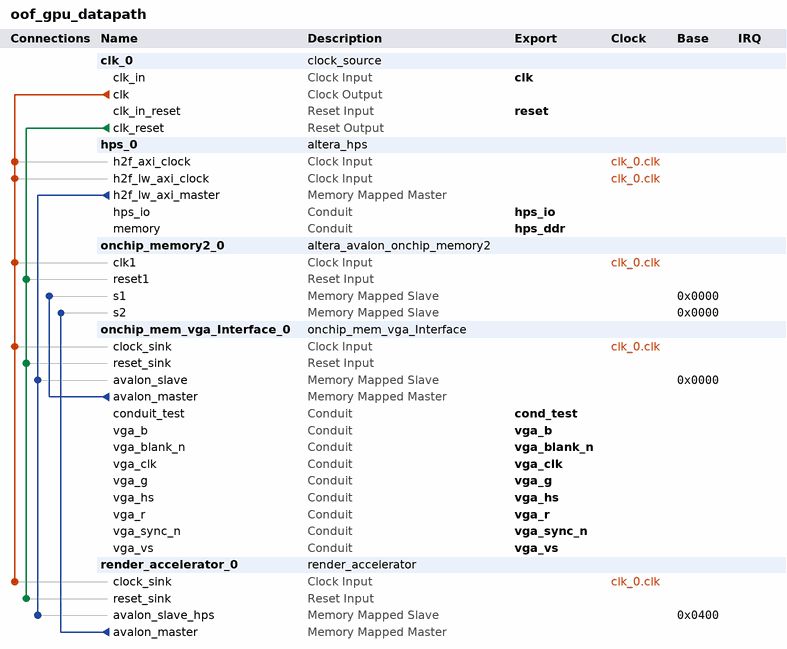
[diagram p0: system contents]
# Platform Designer (Qsys) system oof_gpu_datapath, Cyclone V 5CSEMA5F31C6
# Parameters at their usual value, and those the tool derives, are not listed.
package require -exact qsys 19.1
create_system oof_gpu_datapath
set_project_property DEVICE_FAMILY {Cyclone V}
set_project_property DEVICE 5CSEMA5F31C6

add_instance clk_0 clock_source 19.1
set_instance_parameter_value clk_0 clockFrequency 50000000

add_instance hps_0 altera_hps 19.1
set_instance_parameter_value hps_0 EMAC1_Mode RGMII
set_instance_parameter_value hps_0 EMAC1_PinMuxing {HPS I/O Set 0}
set_instance_parameter_value hps_0 F2SCLK_COLDRST_Enable false
set_instance_parameter_value hps_0 F2SCLK_DBGRST_Enable false
set_instance_parameter_value hps_0 F2SCLK_WARMRST_Enable false
set_instance_parameter_value hps_0 F2SINTERRUPT_Enable false
set_instance_parameter_value hps_0 F2S_Width 0
set_instance_parameter_value hps_0 FPGA_PERIPHERAL_OUTPUT_CLOCK_FREQ_EMAC0_GTX_CLK 125
set_instance_parameter_value hps_0 FPGA_PERIPHERAL_OUTPUT_CLOCK_FREQ_EMAC0_MD_CLK 2.5
set_instance_parameter_value hps_0 FPGA_PERIPHERAL_OUTPUT_CLOCK_FREQ_EMAC1_GTX_CLK 125
set_instance_parameter_value hps_0 FPGA_PERIPHERAL_OUTPUT_CLOCK_FREQ_EMAC1_MD_CLK 2.5
set_instance_parameter_value hps_0 HPS_PROTOCOL DDR3
set_instance_parameter_value hps_0 I2C0_Mode I2C
set_instance_parameter_value hps_0 I2C0_PinMuxing {HPS I/O Set 0}
set_instance_parameter_value hps_0 I2C1_Mode I2C
set_instance_parameter_value hps_0 I2C1_PinMuxing {HPS I/O Set 0}
set_instance_parameter_value hps_0 LWH2F_Enable true
set_instance_parameter_value hps_0 MEM_BANKADDR_WIDTH 3
set_instance_parameter_value hps_0 MEM_CLK_FREQ 400.0
set_instance_parameter_value hps_0 MEM_COL_ADDR_WIDTH 10
set_instance_parameter_value hps_0 MEM_DQ_WIDTH 32
set_instance_parameter_value hps_0 MEM_DRV_STR RZQ/6
set_instance_parameter_value hps_0 MEM_ROW_ADDR_WIDTH 15
set_instance_parameter_value hps_0 MEM_RTT_NOM RZQ/6
set_instance_parameter_value hps_0 MEM_RTT_WR {Dynamic ODT off}
set_instance_parameter_value hps_0 MEM_TCL 7
set_instance_parameter_value hps_0 MEM_TFAW_NS 45.0
set_instance_parameter_value hps_0 MEM_TRAS_NS 36.0
set_instance_parameter_value hps_0 MEM_TRCD_NS 13.125
set_instance_parameter_value hps_0 MEM_TRFC_NS 300.0
set_instance_parameter_value hps_0 MEM_TRP_NS 13.125
set_instance_parameter_value hps_0 MEM_VENDOR JEDEC
set_instance_parameter_value hps_0 MEM_WTCL 7
set_instance_parameter_value hps_0 QSPI_Mode {1 SS}
set_instance_parameter_value hps_0 QSPI_PinMuxing {HPS I/O Set 0}
set_instance_parameter_value hps_0 REF_CLK_FREQ 25.0
set_instance_parameter_value hps_0 S2FCLK_USER1CLK_Enable true
set_instance_parameter_value hps_0 S2FCLK_USER1CLK_FREQ 25.0
set_instance_parameter_value hps_0 S2FCLK_USER2CLK 5
set_instance_parameter_value hps_0 S2F_Width 2
set_instance_parameter_value hps_0 SDIO_Mode {4-bit Data}
set_instance_parameter_value hps_0 SDIO_PinMuxing {HPS I/O Set 0}
set_instance_parameter_value hps_0 SPIM0_Mode {Single Slave Select}
set_instance_parameter_value hps_0 SPIM0_PinMuxing {HPS I/O Set 0}
set_instance_parameter_value hps_0 SPIM1_Mode N/A
set_instance_parameter_value hps_0 SPIM1_PinMuxing Unused
set_instance_parameter_value hps_0 STM_Enable false
set_instance_parameter_value hps_0 TIMING_BOARD_AC_SKEW 0.02
set_instance_parameter_value hps_0 TIMING_BOARD_AC_TO_CK_SKEW 0.01
set_instance_parameter_value hps_0 TIMING_BOARD_DQ_TO_DQS_SKEW 0.05
set_instance_parameter_value hps_0 TIMING_BOARD_MAX_CK_DELAY 0.03
set_instance_parameter_value hps_0 TIMING_BOARD_MAX_DQS_DELAY 0.02
set_instance_parameter_value hps_0 TIMING_BOARD_SKEW_BETWEEN_DQS 0.06
set_instance_parameter_value hps_0 TIMING_BOARD_SKEW_CKDQS_DIMM_MAX 0.12
set_instance_parameter_value hps_0 TIMING_BOARD_SKEW_CKDQS_DIMM_MIN 0.06
set_instance_parameter_value hps_0 TIMING_BOARD_SKEW_WITHIN_DQS 0.01
set_instance_parameter_value hps_0 TIMING_TDH 65
set_instance_parameter_value hps_0 TIMING_TDQSCK 255
set_instance_parameter_value hps_0 TIMING_TDQSQ 125
set_instance_parameter_value hps_0 TIMING_TDS 30
set_instance_parameter_value hps_0 TIMING_TDSH 0.4
set_instance_parameter_value hps_0 TIMING_TIH 140
set_instance_parameter_value hps_0 TIMING_TIS 190
set_instance_parameter_value hps_0 TIMING_TQSH 0.38
set_instance_parameter_value hps_0 UART0_Mode {No Flow Control}
set_instance_parameter_value hps_0 UART0_PinMuxing {HPS I/O Set 0}
set_instance_parameter_value hps_0 USB1_Mode SDR
set_instance_parameter_value hps_0 USB1_PinMuxing {HPS I/O Set 0}
set_instance_parameter_value hps_0 desired_cfg_clk_mhz 100.0
set_instance_parameter_value hps_0 desired_qspi_clk_mhz 400.0
set_instance_parameter_value hps_0 use_default_mpu_clk false

add_instance onchip_memory2_0 altera_avalon_onchip_memory2 19.1
set_instance_parameter_value onchip_memory2_0 blockType M10K
set_instance_parameter_value onchip_memory2_0 dataWidth 8
set_instance_parameter_value onchip_memory2_0 dualPort true
set_instance_parameter_value onchip_memory2_0 initMemContent true
set_instance_parameter_value onchip_memory2_0 initializationFileName onchip_mem.hex
set_instance_parameter_value onchip_memory2_0 memorySize 131072
set_instance_parameter_value onchip_memory2_0 readDuringWriteMode OLD_DATA
set_instance_parameter_value onchip_memory2_0 singleClockOperation true

add_instance onchip_mem_vga_Interface_0 onchip_mem_vga_Interface 1.0
set_instance_parameter_value onchip_mem_vga_Interface_0 CHAR1_B 240
set_instance_parameter_value onchip_mem_vga_Interface_0 CHAR1_G 32
set_instance_parameter_value onchip_mem_vga_Interface_0 CHAR1_R 160
set_instance_parameter_value onchip_mem_vga_Interface_0 CHAR2_B 255
set_instance_parameter_value onchip_mem_vga_Interface_0 CHAR2_G 255
set_instance_parameter_value onchip_mem_vga_Interface_0 CHAR2_R 0
set_instance_parameter_value onchip_mem_vga_Interface_0 CHAR_HEIGHT 20
set_instance_parameter_value onchip_mem_vga_Interface_0 CHAR_WIDTH 20
set_instance_parameter_value onchip_mem_vga_Interface_0 EYE_B 255
set_instance_parameter_value onchip_mem_vga_Interface_0 EYE_G 255
set_instance_parameter_value onchip_mem_vga_Interface_0 EYE_R 255

add_instance render_accelerator_0 render_accelerator 1.0
set_instance_parameter_value render_accelerator_0 char_height 24
set_instance_parameter_value render_accelerator_0 char_width 16
set_instance_parameter_value render_accelerator_0 character 1
set_instance_parameter_value render_accelerator_0 finish 3
set_instance_parameter_value render_accelerator_0 idle 0
set_instance_parameter_value render_accelerator_0 inc_x 17
set_instance_parameter_value render_accelerator_0 inc_y 18
set_instance_parameter_value render_accelerator_0 square 0

# connections
add_connection clk_0.clk hps_0.h2f_axi_clock clock
add_connection clk_0.clk hps_0.h2f_lw_axi_clock clock
add_connection clk_0.clk onchip_mem_vga_Interface_0.clock_sink clock
add_connection clk_0.clk onchip_memory2_0.clk1 clock
add_connection clk_0.clk render_accelerator_0.clock_sink clock
add_connection clk_0.clk_reset onchip_mem_vga_Interface_0.reset_sink reset
add_connection clk_0.clk_reset onchip_memory2_0.reset1 reset
add_connection clk_0.clk_reset render_accelerator_0.reset_sink reset
add_connection hps_0.h2f_lw_axi_master onchip_mem_vga_Interface_0.avalon_slave avalon
set_connection_parameter_value hps_0.h2f_lw_axi_master/onchip_mem_vga_Interface_0.avalon_slave baseAddress 0x0000
add_connection hps_0.h2f_lw_axi_master render_accelerator_0.avalon_slave_hps avalon
set_connection_parameter_value hps_0.h2f_lw_axi_master/render_accelerator_0.avalon_slave_hps baseAddress 0x0400
add_connection onchip_mem_vga_Interface_0.avalon_master onchip_memory2_0.s1 avalon
set_connection_parameter_value onchip_mem_vga_Interface_0.avalon_master/onchip_memory2_0.s1 baseAddress 0x0000
add_connection render_accelerator_0.avalon_master onchip_memory2_0.s2 avalon
set_connection_parameter_value render_accelerator_0.avalon_master/onchip_memory2_0.s2 baseAddress 0x0000

# exported interfaces
add_interface clk clock sink
set_interface_property clk EXPORT_OF clk_0.clk_in
add_interface cond_test conduit end
set_interface_property cond_test EXPORT_OF onchip_mem_vga_Interface_0.conduit_test
add_interface hps_ddr conduit end
set_interface_property hps_ddr EXPORT_OF hps_0.memory
add_interface hps_io conduit end
set_interface_property hps_io EXPORT_OF hps_0.hps_io
add_interface reset reset sink
set_interface_property reset EXPORT_OF clk_0.clk_in_reset
add_interface vga_b conduit end
set_interface_property vga_b EXPORT_OF onchip_mem_vga_Interface_0.vga_b
add_interface vga_blank_n conduit end
set_interface_property vga_blank_n EXPORT_OF onchip_mem_vga_Interface_0.vga_blank_n
add_interface vga_clk conduit end
set_interface_property vga_clk EXPORT_OF onchip_mem_vga_Interface_0.vga_clk
add_interface vga_g conduit end
set_interface_property vga_g EXPORT_OF onchip_mem_vga_Interface_0.vga_g
add_interface vga_hs conduit end
set_interface_property vga_hs EXPORT_OF onchip_mem_vga_Interface_0.vga_hs
add_interface vga_r conduit end
set_interface_property vga_r EXPORT_OF onchip_mem_vga_Interface_0.vga_r
add_interface vga_sync_n conduit end
set_interface_property vga_sync_n EXPORT_OF onchip_mem_vga_Interface_0.vga_sync_n
add_interface vga_vs conduit end
set_interface_property vga_vs EXPORT_OF onchip_mem_vga_Interface_0.vga_vs

set_interconnect_requirement {$system} qsys_mm.clockCrossingAdapter HANDSHAKE
set_interconnect_requirement {$system} qsys_mm.enableEccProtection FALSE
set_interconnect_requirement {$system} qsys_mm.insertDefaultSlave FALSE
set_interconnect_requirement {$system} qsys_mm.maxAdditionalLatency 1

save_system oof_gpu_datapath.qsys
